# EAGLE schematic DA_uno_shield_0_2 (EAGLE 7.5.0)
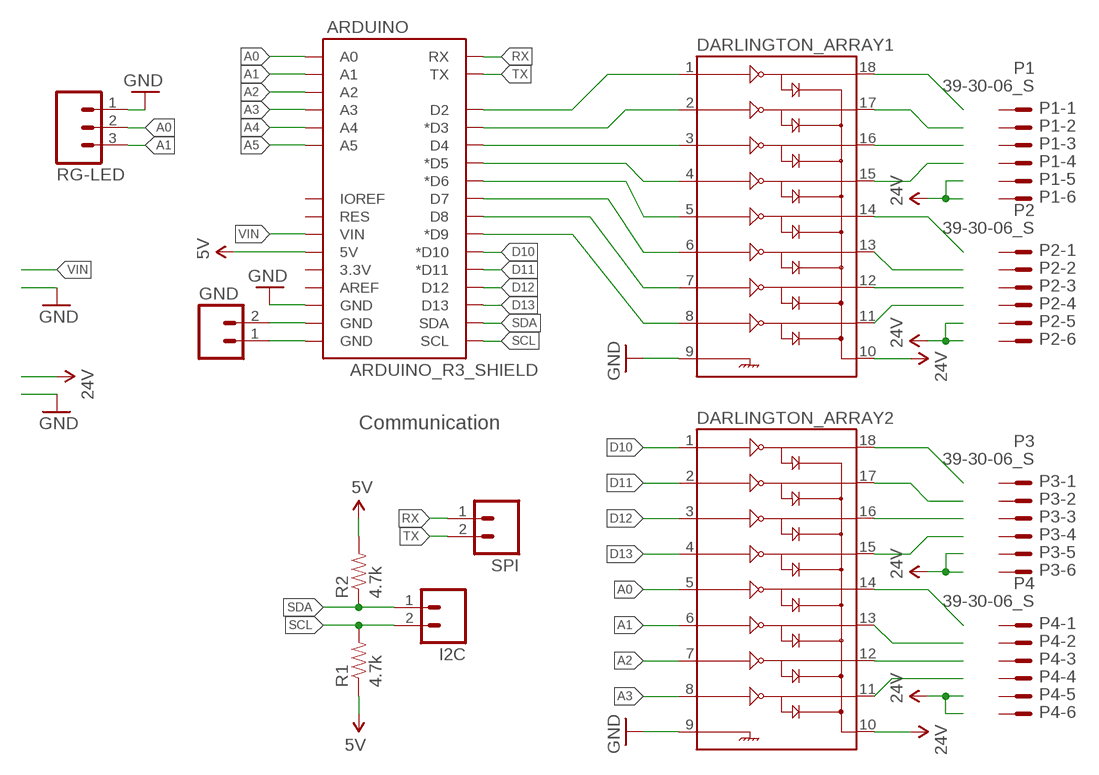
[diagram p0: schematic, sheet 1]

## Parts
ARDUINO  ARDUINO_R3_SHIELD  [UNO_R3_SHIELD]
DARLINGTON_ARRAY1  ULN2803DIP  [DIL18]
DARLINGTON_ARRAY2  ULN2803DIP  [DIL18]
GND  M02LOCK_LONGPADS  [1X02_LOCK_LONGPADS]
I2C  M02LOCK_LONGPADS  [1X02_LOCK_LONGPADS]
P1  39-30-06_S  [39-30-?06?]
P2  39-30-06_S  [39-30-?06?]
P3  39-30-06_S  [39-30-?06?]
P4  39-30-06_S  [39-30-?06?]
R1  4.7k  RESISTORKIT  [AXIAL-0.3-KIT]
R2  4.7k  RESISTORKIT  [AXIAL-0.3-KIT]
RG-LED  M03LONGPADS  [1X03_LONGPADS]
SPI  M02LOCK_LONGPADS  [1X02_LOCK_LONGPADS]

## Nets
5V: ARDUINO.5V R1.P$1 R2.P$2
A0: ARDUINO.A0 DARLINGTON_ARRAY2.5 RG-LED.2
A1: ARDUINO.A1 DARLINGTON_ARRAY2.6 RG-LED.3
A2: ARDUINO.A2 DARLINGTON_ARRAY2.7
A3: ARDUINO.A3 DARLINGTON_ARRAY2.8
A4: ARDUINO.A4
A5: ARDUINO.A5
D10: ARDUINO.D10(*D10) DARLINGTON_ARRAY2.1
D11: ARDUINO.D11(*D11) DARLINGTON_ARRAY2.2
D12: ARDUINO.D12 DARLINGTON_ARRAY2.3
D13: ARDUINO.D13 DARLINGTON_ARRAY2.4
GND: ARDUINO.GND@2(GND) DARLINGTON_ARRAY1.9 DARLINGTON_ARRAY2.9 RG-LED.1
N$1: DARLINGTON_ARRAY1.14
N$2: DARLINGTON_ARRAY1.13
N$3: DARLINGTON_ARRAY1.12
N$4: DARLINGTON_ARRAY1.11
N$5: ARDUINO.D6(*D6) DARLINGTON_ARRAY1.5
N$6: ARDUINO.D7 DARLINGTON_ARRAY1.6
N$7: ARDUINO.D8 DARLINGTON_ARRAY1.7
N$8: ARDUINO.D9(*D9) DARLINGTON_ARRAY1.8
N$21: ARDUINO.GND@1(GND) GND.2
N$22: ARDUINO.GND@0(GND) GND.1
N$30: DARLINGTON_ARRAY2.18
N$33: ARDUINO.D2 DARLINGTON_ARRAY1.1
N$34: DARLINGTON_ARRAY1.18
N$35: DARLINGTON_ARRAY1.17
N$36: DARLINGTON_ARRAY1.16
N$37: DARLINGTON_ARRAY1.15
N$38: ARDUINO.D3(*D3) DARLINGTON_ARRAY1.2
N$39: ARDUINO.D4 DARLINGTON_ARRAY1.3
N$40: ARDUINO.D5(*D5) DARLINGTON_ARRAY1.4
N$41: DARLINGTON_ARRAY2.17
N$42: DARLINGTON_ARRAY2.16
N$43: DARLINGTON_ARRAY2.15
N$44: DARLINGTON_ARRAY2.14
N$45: DARLINGTON_ARRAY2.13
N$46: DARLINGTON_ARRAY2.12
N$47: DARLINGTON_ARRAY2.11
RX: ARDUINO.RX SPI.1
SCL: ARDUINO.SCL I2C.2 R1.P$2
SDA: ARDUINO.SDA I2C.1 R2.P$1
TX: ARDUINO.TX SPI.2
VCC: DARLINGTON_ARRAY1.10 DARLINGTON_ARRAY2.10 ; supply symbol labelled 24V
VIN: ARDUINO.VIN
Unconnected: ARDUINO.3.3V ARDUINO.AREF ARDUINO.IOREF ARDUINO.RES P1.1 P1.2 P1.3 P1.4 P1.5 P1.6 P2.1 P2.2 P2.3 P2.4 P2.5 P2.6 P3.1 P3.2 P3.3 P3.4 P3.5 P3.6 P4.1 P4.2 P4.3 P4.4 P4.5 P4.6

## Notes on the sheet
- Communication

## Library data of the parts
ARDUINO = Nathans-Arduinos:ARDUINO_R3_SHIELD: Shield form compatible with the Arduino Uno R3.
DARLINGTON_ARRAY1 DARLINGTON_ARRAY2 = SparkFun-PowerIC:ULN2803: Darlington Driver ULN2803 Darlington array. 500mA max per channel, 8-channel package. Spark Fun Electronics SKU : COM-00312
GND I2C SPI = SparkFun-Connectors:M02: Standard 2-pin 0.1" header. Use with - straight break away headers ( PRT-00116) - right angle break away headers (PRT-00553) - swiss pins (PRT-00743) - machine pins (PRT-00117) - female headers (PRT-00115) Molex polarized connector foot print use with: PRT-08233 with associated crimp pins and housings. 2.54_SCREWTERM for use with PRT-10571. 3.5mm Screw Terminal footprints for PRT-08084 5mm Screw Terminal footprints for use with PRT-08432
P1-P4 = con-molex-mini-fit:39-30-?06?_S: HEADER
R1 R2 = SparkFun-Resistors:RESISTOR: Resistor Basic schematic elements and footprints for 0603, 1206, and PTH resistors.
RG-LED = SparkFun-Connectors:M03: Header 3 Standard 3-pin 0.1" header. Use with straight break away headers (SKU : PRT-00116), right angle break away headers (PRT-00553), swiss pins (PRT-00743), machine pins (PRT-00117), and female headers (PRT-00115). Molex polarized connector foot print use with SKU : PRT-08232 with associated crimp pins and housings.

## Net classes
0 default: width 0.457 mm, drill 0.508 mm, clearance 0.381 mm
1 GND: width 0.508 mm, drill 0.762 mm, clearance 0.508 mm